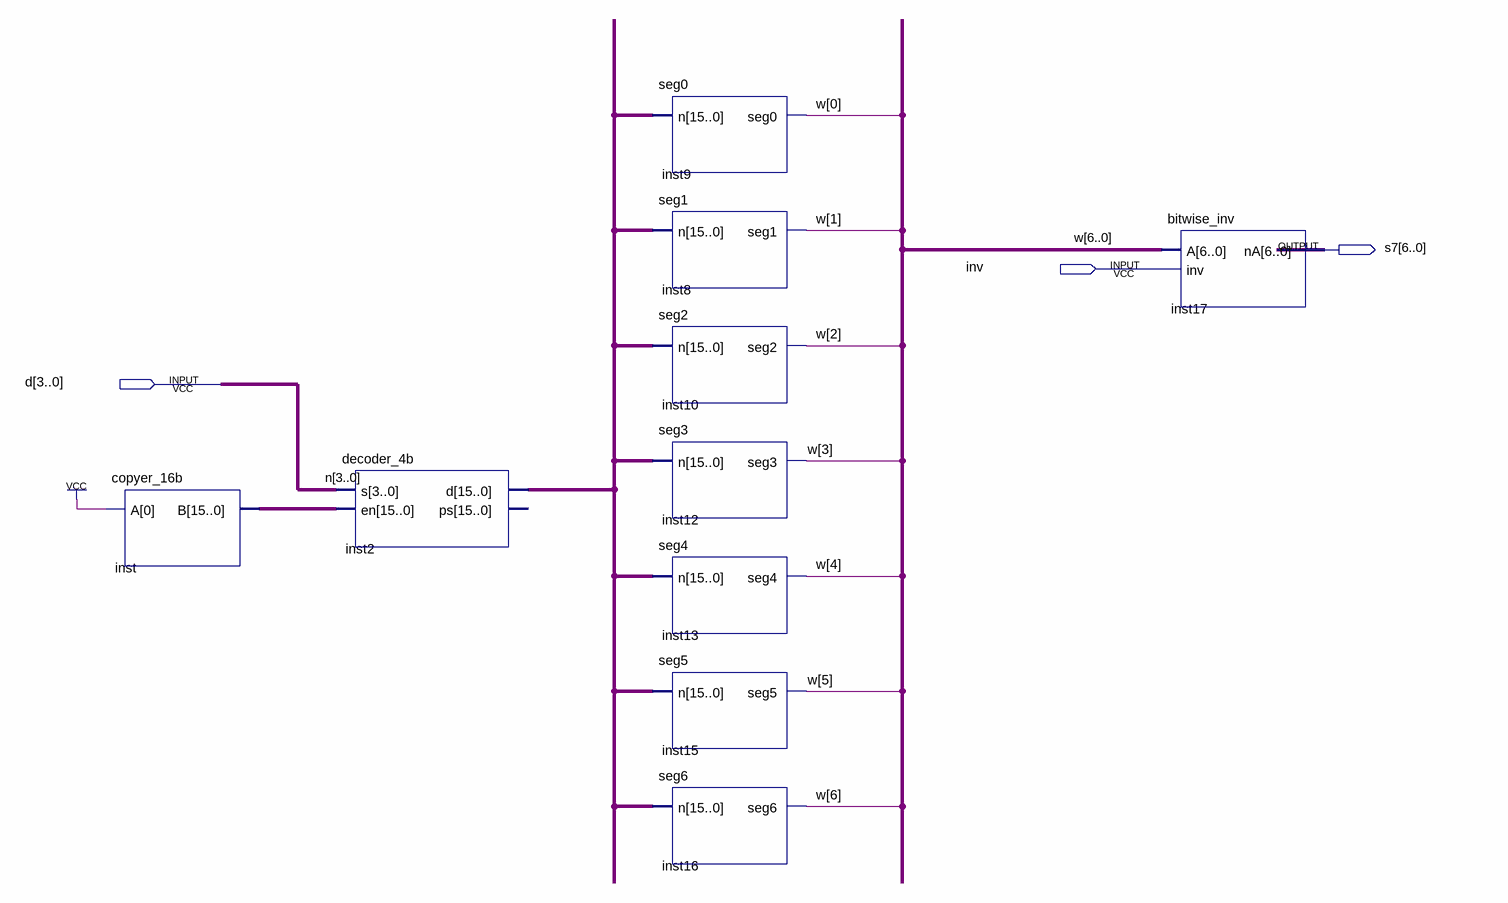
[diagram p0: schematic sheet]
// Quartus schematic decoder_4b_seg7.bdf as structural Verilog: 10 symbols, 3 pins
module decoder_4b_seg7 (
  input  inv,
  input  [3:0] d,
  output [6:0] s7
);

  wire [6:0] w;
  wire [15:0] inst2_d, inst_b;

  copyer_16b inst (.A(1'b1), .B(inst_b));
  decoder_4b inst2 (.s(d), .en(inst_b), .d(inst2_d));  // open: ps
  seg0 inst9 (.n(inst2_d), .seg0(w[0]));
  seg1 inst8 (.n(inst2_d), .seg1(w[1]));
  seg2 inst10 (.n(inst2_d), .seg2(w[2]));
  seg3 inst12 (.n(inst2_d), .seg3(w[3]));
  seg4 inst13 (.n(inst2_d), .seg4(w[4]));
  seg5 inst15 (.n(inst2_d), .seg5(w[5]));
  seg6 inst16 (.n(inst2_d), .seg6(w[6]));
  bitwise_inv inst17 (.A(w), .inv(inv), .nA(s7));

  // Other names for the same wires on the sheet: n[3:0] = d
endmodule
